# EAGLE schematic Main Board with 3.3v (EAGLE 7.1.0)
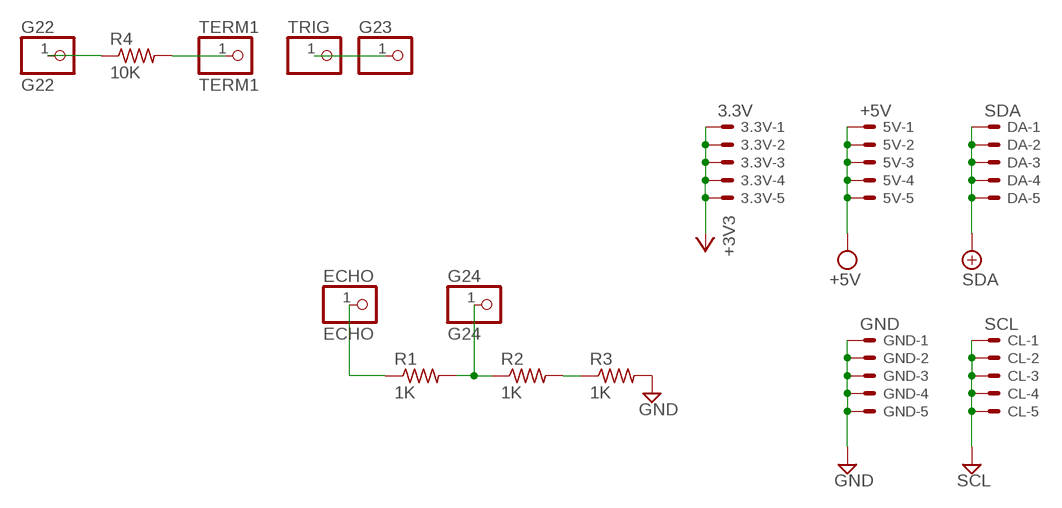
[diagram p0: schematic, sheet 1]

## Parts
3.3V  3.3V  22-23-2051  [22-23-2051]
5V  +5V  22-23-2051  [22-23-2051]
CL  SCL  22-23-2051  [22-23-2051]
DA  SDA  22-23-2051  [22-23-2051]
ECHO  ECHO  PINHD-1X1  [1X01]
G22  G22  PINHD-1X1  [1X01]
G23  PINHD-1X1  [1X01]
G24  G24  PINHD-1X1  [1X01]
GND  GND  22-23-2051  [22-23-2051]
R1  1K  R-US_0204/7  [0204/7]
R2  1K  R-US_0204/7  [0204/7]
R3  1K  R-US_0204/7  [0204/7]
R4  10K  R-US_0204/7  [0204/7]
TERM1  TERM1  PINHD-1X1  [1X01]
TRIG  PINHD-1X1  [1X01]

## Nets
ECHO: ECHO.1 R1.1
GND: GND.1 GND.2 GND.3 GND.4 GND.5 R3.2
GND1: R2.2 R3.1
GPIO24: G24.1 R1.2 R2.1
N$1: G23.1 TRIG.1
N$2: G22.1 R4.1
N$3: R4.2 TERM1.1
N_+3V3: 3.3V.1 3.3V.2 3.3V.3 3.3V.4 3.3V.5 ; supply symbol labelled +3V3
N_+5V: 5V.1 5V.2 5V.3 5V.4 5V.5 ; supply symbol labelled +5V
N_SDA: DA.1 DA.2 DA.3 DA.4 DA.5 ; supply symbol labelled SDA
SCL: CL.1 CL.2 CL.3 CL.4 CL.5

## Library data of the parts
3.3V 5V CL DA GND = con-molex:22-23-2051: .100" (2.54mm) Center Header - 5 Pin; MF: MOLEX; MPN: 22-23-2051; OC_FARNELL: 1462952; OC_NEWARK: 38C9178
ECHO G22-G24 TERM1 TRIG = pinhead:PINHD-1X1: PIN HEADER
R1-R4 = resistor:R-US_: RESISTOR, American symbol